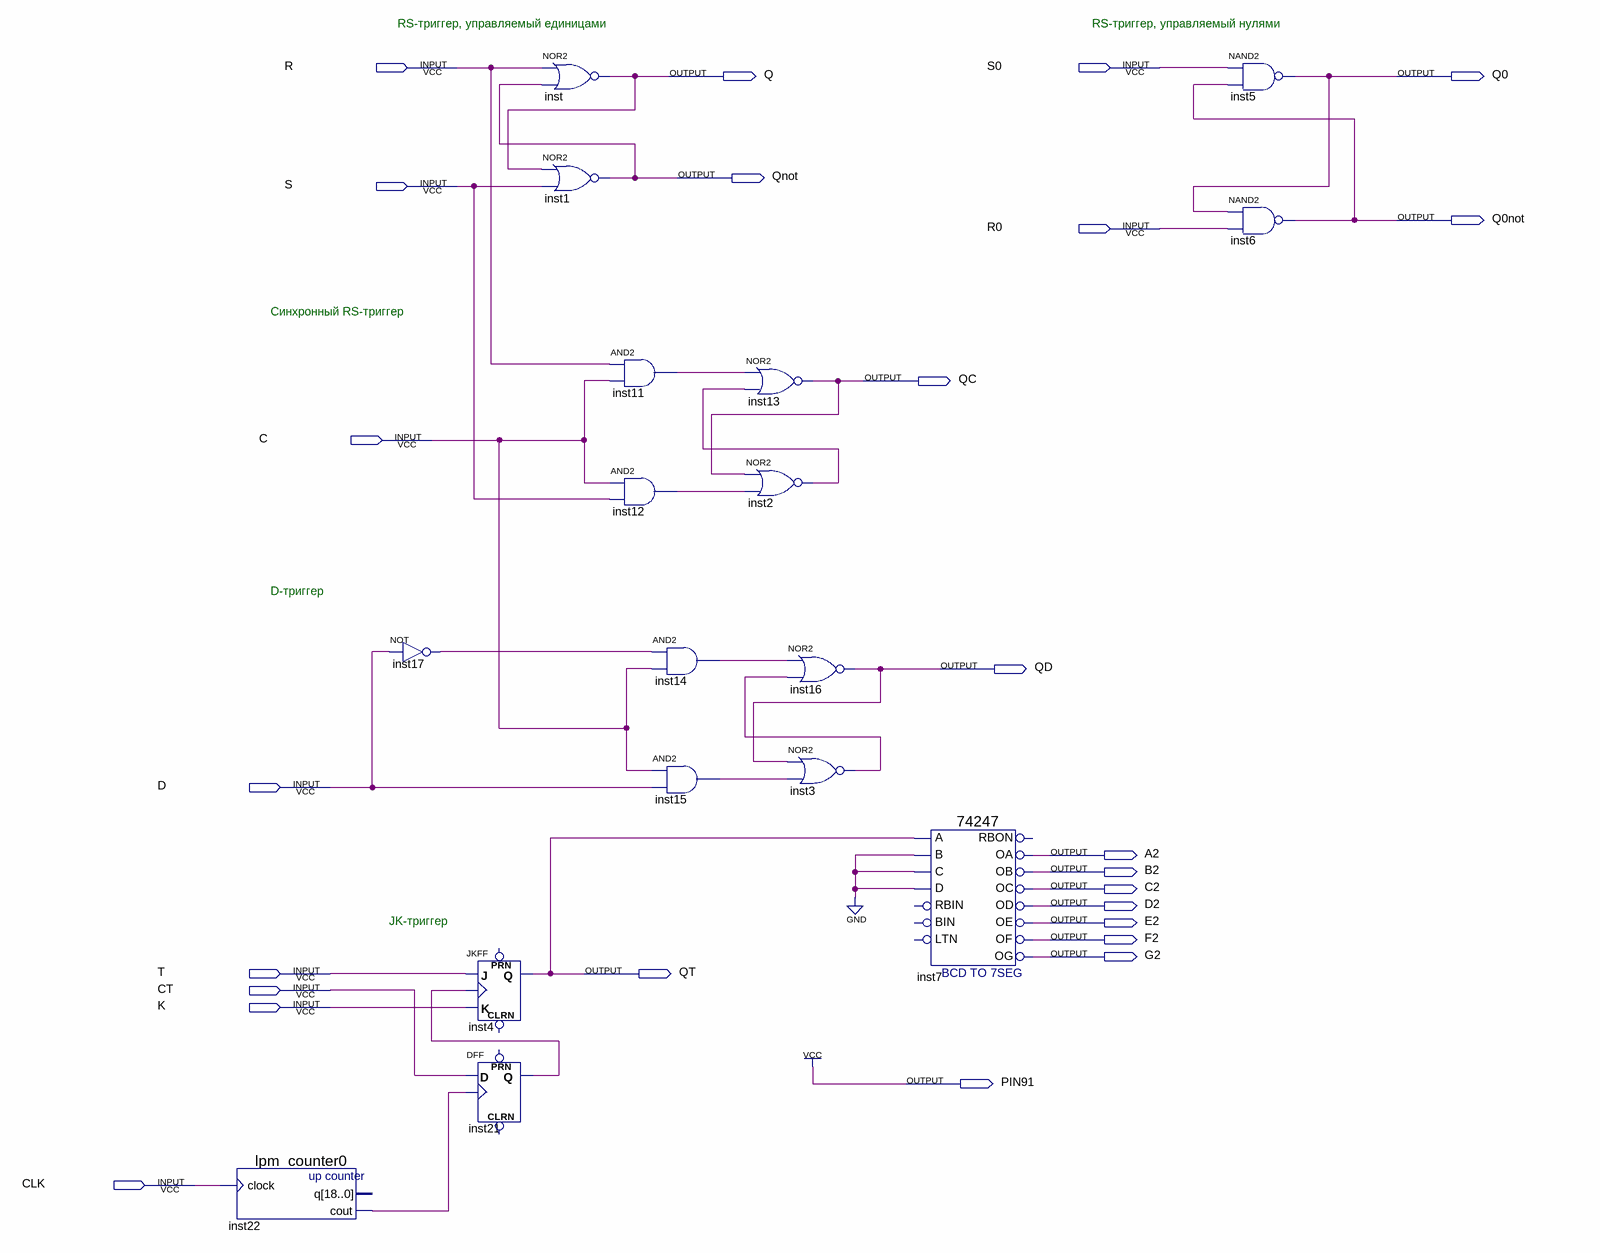
[diagram p0: schematic sheet]
// Quartus schematic Triggers.bdf as structural Verilog: 17 symbols, 25 pins
module Triggers (
  input  R,
  input  S0,
  input  S,
  input  R0,
  input  C,
  input  D,
  input  T,
  input  CT,
  input  K,
  input  CLK,
  output Q,
  output Q0,
  output Qnot,
  output Q0not,
  output QC,
  output QD,
  output A2,
  output B2,
  output C2,
  output D2,
  output E2,
  output F2,
  output G2,
  output QT,
  output PIN91
);

  wire inst2_out, inst3_out, inst11_out, inst12_out, inst14_out, inst15_out, inst17_out, inst21_q,
       inst22_cout;

  lpm_counter0 inst22 (.clock(CLK), .cout(inst22_cout));  // open: q
  not inst17 (inst17_out, D);
  JKFF inst4 (.K(K), .J(T), .CLK(inst21_q), .Q(QT));  // open: PRN, CLRN
  DFF inst21 (.CLK(inst22_cout), .D(CT), .Q(inst21_q));  // open: CLRN, PRN
  nor inst (Q, R, Qnot);
  nor inst1 (Qnot, Q, S);
  and inst11 (inst11_out, R, C);
  and inst12 (inst12_out, C, S);
  and inst14 (inst14_out, inst17_out, C);
  and inst15 (inst15_out, C, D);
  nor inst13 (QC, inst11_out, inst2_out);
  nor inst2 (inst2_out, QC, inst12_out);
  nor inst16 (QD, inst14_out, inst3_out);
  nor inst3 (inst3_out, QD, inst15_out);
  \74247  inst7 (
    .A(QT), .B(1'b0), .C(1'b0), .D(1'b0), .OF(F2), .OC(C2), .OD(D2), .OE(E2), .OA(A2), .OB(B2), .OG(G2));  // open: LTN, BIN, RBIN, RBON
  nand inst5 (Q0, S0, Q0not);
  nand inst6 (Q0not, Q0, R0);

  assign PIN91 = 1'b1;

  // Notes on the sheet:
  //   RS-триггер, управляемый единицами
  //   RS-триггер, управляемый нулями
  //   Синхронный RS-триггер
  //   D-триггер
  //   JK-триггер
endmodule
